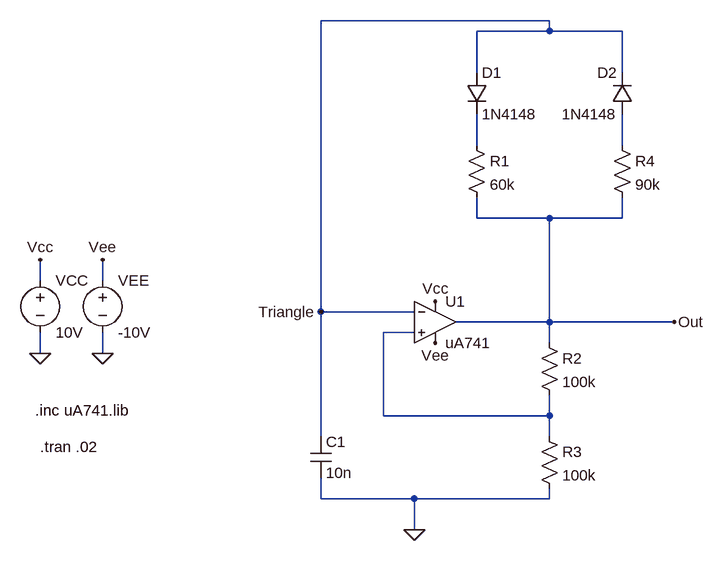
[diagram p0: schematic 4_12.asc]
4_12.asc, the LTspice schematic file:
Version 4
SHEET 1 940 680
WIRE 688 -384 336 -384
WIRE 688 -368 688 -384
WIRE 688 -368 576 -368
WIRE 800 -368 688 -368
WIRE 576 -304 576 -368
WIRE 800 -304 800 -368
WIRE 576 -192 576 -240
WIRE 800 -192 800 -240
WIRE 576 -80 576 -112
WIRE 688 -80 576 -80
WIRE 800 -80 800 -112
WIRE 800 -80 688 -80
WIRE -96 16 -96 -16
WIRE 0 16 0 -16
WIRE 336 64 336 -384
WIRE 480 64 336 64
WIRE 688 80 688 -80
WIRE 688 80 544 80
WIRE 880 80 688 80
WIRE 480 96 432 96
WIRE 688 112 688 80
WIRE -96 128 -96 96
WIRE 0 128 0 96
WIRE 432 224 432 96
WIRE 688 224 688 192
WIRE 688 224 432 224
WIRE 336 256 336 64
WIRE 688 256 688 224
WIRE 336 352 336 320
WIRE 480 352 336 352
WIRE 688 352 688 336
WIRE 688 352 480 352
WIRE 480 400 480 352
FLAG -96 128 0
FLAG 0 128 0
FLAG -96 -16 Vcc
FLAG 0 -16 Vee
FLAG 512 48 Vcc
FLAG 512 112 Vee
FLAG 480 400 0
FLAG 880 80 Out
FLAG 336 64 Triangle
SYMBOL voltage -96 0 R0
WINDOW 123 0 0 Left 0
WINDOW 39 0 0 Left 0
SYMATTR InstName VCC
SYMATTR Value 10V
SYMBOL voltage 0 0 R0
WINDOW 123 0 0 Left 0
WINDOW 39 0 0 Left 0
SYMATTR InstName VEE
SYMATTR Value -10V
SYMBOL OpAmps\\opamp2 512 16 R0
SYMATTR InstName U1
SYMATTR Value uA741
SYMBOL res 672 96 R0
SYMATTR InstName R2
SYMATTR Value 100k
SYMBOL res 672 240 R0
SYMATTR InstName R3
SYMATTR Value 100k
SYMBOL cap 320 256 R0
SYMATTR InstName C1
SYMATTR Value 10n
SYMBOL diode 560 -304 R0
SYMATTR InstName D1
SYMATTR Value 1N4148
SYMBOL diode 816 -240 R180
WINDOW 0 24 64 Left 2
WINDOW 3 24 0 Left 2
SYMATTR InstName D2
SYMATTR Value 1N4148
SYMBOL res 560 -208 R0
SYMATTR InstName R1
SYMATTR Value 60k
SYMBOL res 784 -208 R0
SYMATTR InstName R4
SYMATTR Value 90k
TEXT -104 216 Left 2 !.inc uA741.lib
TEXT -96 272 Left 2 !.tran .02

The netlist it stands for:
* 4_12.asc
VCC Vcc 0 10V
VEE Vee 0 -10V
XU1 N003 Triangle Vcc Vee Out uA741  ; pins In+ In- V+ V- OUT
R2 Out N003 100k
R3 N003 0 100k
C1 Triangle 0 10n
D1 Triangle N001 1N4148
D2 N002 Triangle 1N4148
R1 N001 Out 60k
R4 N002 Out 90k
.model D D
.lib standard.dio
.inc uA741.lib
.tran .02
.backanno
.end